# Altium schematic sheet usb_isolated_uart_x2.SchDoc
size A4; Organization: UNSW Solar Racing Team; Address3: UNSW; Address4: Sydney NSW 2052; Address2: Electrical Engineering; Address1: Room 342
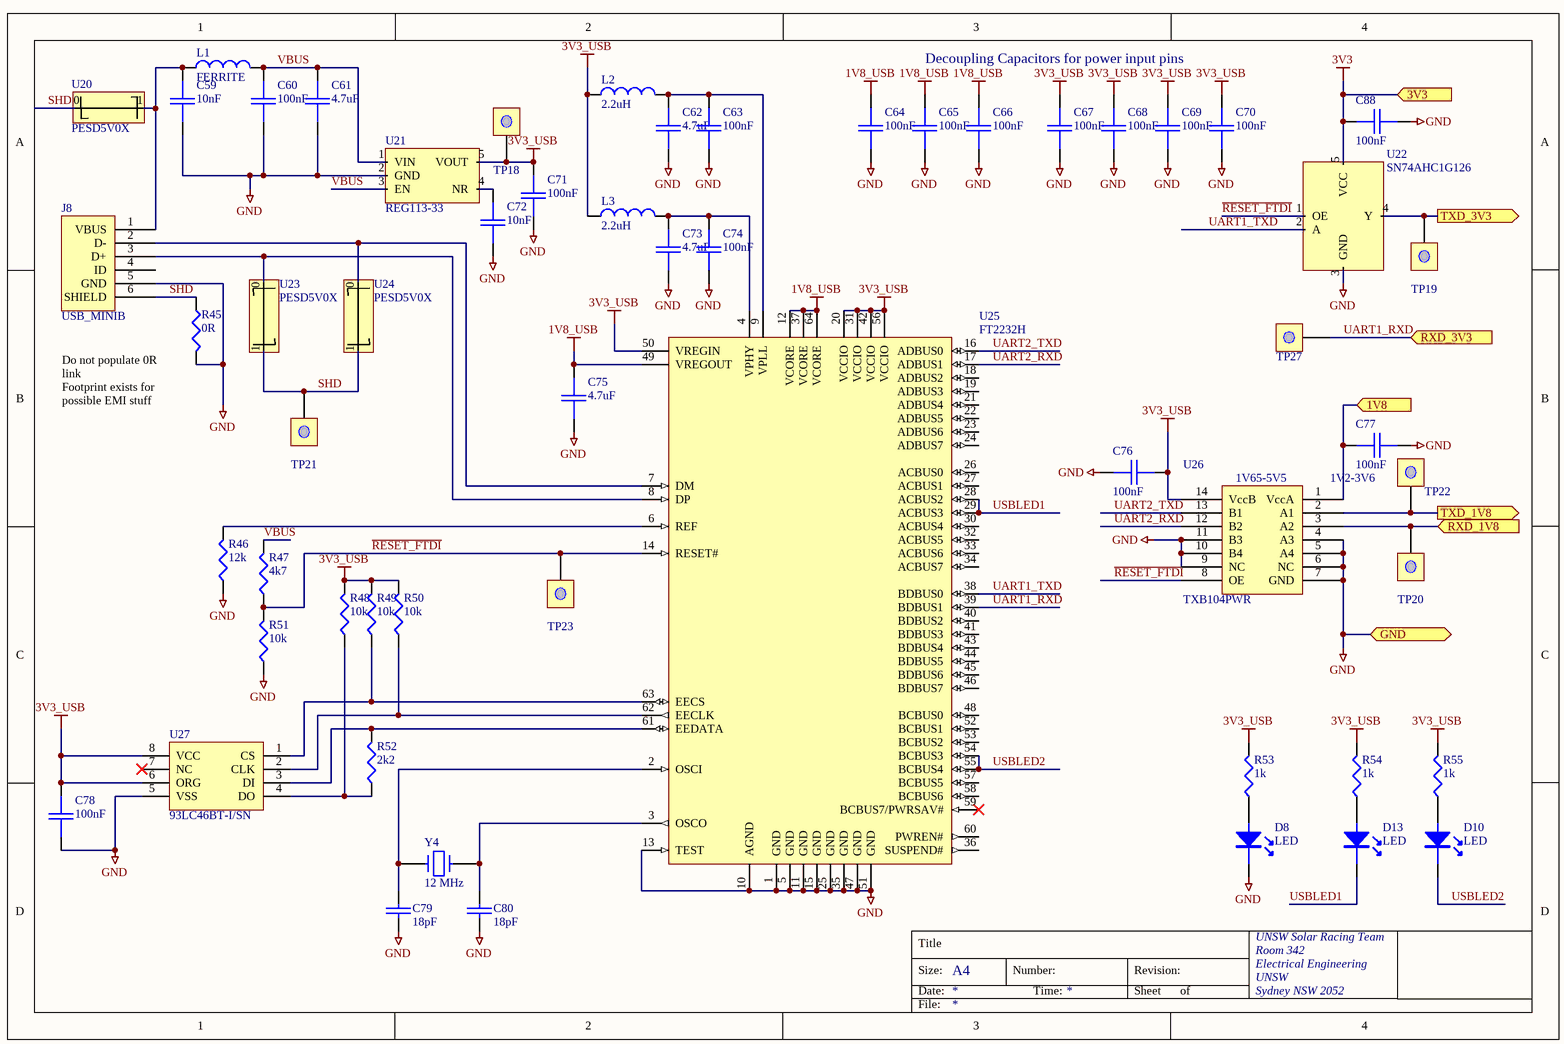
[diagram p0: usb_isolated_uart_x2.SchDoc]

## Parts
C59  10nF  [0603]
C60  100nF  [0603]
C61  4.7uF  [0603]
C62  4.7uF  [0603]
C63  100nF  [0603]
C64  100nF  [0603]
C65  100nF  [0603]
C66  100nF  [0603]
C67  100nF  [0603]
C68  100nF  [0603]
C69  100nF  [0603]
C70  100nF  [0603]
C71  100nF  [0603]
C72  10nF  [0603]
C73  4.7uF  [0603]
C74  100nF  [0603]
C75  4.7uF  [0603]
C76  100nF  [0603]
C77  100nF  [0603]
C78  100nF  [0603]
C79  18pF  [0603]
C80  18pF  [0603]
C88  100nF  [0603]
D8  LED  [0805LED]
D10  LED  [0805LED]
D13  LED  [0805LED]
J8  USB_MINIB  [USB_MINIB]
L1  FERRITE  [0603]
L2  2.2uH  [1210]
L3  2.2uH  [1210]
R45  0R  [1206]
R46  12k  [0603]
R47  4k7  [0603]
R48  10k  [0603]
R49  10k  [0603]
R50  10k  [0603]
R51  10k  [0603]
R52  2k2  [0603]
R53  1k  [0603]
R54  1k  [0603]
R55  1k  [0603]
TP18  3V3USB  [TESTPOINT]  (value not drawn)
TP19  TXD3V3  [TESTPOINT]  (value not drawn)
TP20  RXD1V8  [TESTPOINT]  (value not drawn)
TP21  SHD  [TESTPOINT]  (value not drawn)
TP22  TXD1V8  [TESTPOINT]  (value not drawn)
TP23  FTDI_RST  [TESTPOINT]  (value not drawn)
TP27  RXD3V3  [TESTPOINT]  (value not drawn)
U20  PESD5V0X  [SOD323]
U21  REG113-33  [SOT23-5]
U22  SN74AHC1G126  [SOT23-5]
U23  PESD5V0X  [SOD323]
U24  PESD5V0X  [SOD323]
U25  FT2232H  [QFP64]
U26  TXB104PWR  [TSSOP14-L]
U27  93LC46BT-I/SN  [SO8]
Y4  12 MHz  [HC49/4H]

## Ports
1V8 (in), 3V3 (in), GND (bidir), RXD_1V8 (in), RXD_3V3 (in), TXD_1V8 (out), TXD_3V3 (out)

## Nets
1V8_USB: C64.1 C65.1 C66.1 C75.1 U25.12(VCORE) U25.37(VCORE) U25.49(VREGOUT) U25.64(VCORE)
3V3: C88.2 U22.5(VCC) ; port 3V3
3V3_USB: C67.1 C68.1 C69.1 C70.1 C71.1 C76.2 C78.1 L2.1 L3.1 R48.2 R49.2 R50.2 R53.2 R54.2 R55.2 TP18.0(TP) U21.5(VOUT) U25.20(VCCIO) U25.31(VCCIO) U25.42(VCCIO) U25.50(VREGIN) U25.56(VCCIO) U26.14(VccB) U27.6(ORG) U27.8(VCC)
GND: C59.1 C60.2 C61.2 C62.2 C63.2 C64.2 C65.2 C66.2 C67.2 C68.2 C69.2 C70.2 C71.2 C72.2 C73.2 C74.2 C75.2 C76.1 C77.2 C78.2 C79.2 C80.2 C88.1 D8.K J8.5(GND) R45.2 R46.1 R51.1 U21.2(GND) U22.3(GND) U25.1(GND) U25.5(GND) U25.10(AGND) U25.11(GND) U25.13(TEST) U25.15(GND) U25.25(GND) U25.35(GND) U25.47(GND) U25.51(GND) U26.4(A3) U26.5(A4) U26.6(NC) U26.7(GND) U26.9(NC) U26.10(B4) U26.11(B3) U27.5(VSS) ; port GND
1V8: C77.1 U26.1(VccA) ; port 1V8
~{RESET_FTDI}: R47.1 R51.2 TP23.0(TP) U22.1(OE) U25.14(RESET#) U26.8(OE)
RXD_1V8: TP20.0(TP) U26.3(A2) ; port RXD_1V8
SHD: J8.6(SHIELD) R45.1 TP21.0(TP) U20.0 U23.1 U24.1
TXD_1V8: TP22.0(TP) U26.2(A1) ; port TXD_1V8
TXD_3V3: TP19.0(TP) U22.4(Y) ; port TXD_3V3
UART1_RXD: TP27.0(TP) U25.39(BDBUS1) ; port RXD_3V3
UART1_TXD: U22.2(A) U25.38(BDBUS0)
UART2_RXD: U25.17(ADBUS1) U26.12(B2)
UART2_TXD: U25.16(ADBUS0) U26.13(B1)
USBLED1: D13.K U25.28(ACBUS2) U25.29(ACBUS3)
USBLED2: D10.K U25.54(BCBUS3) U25.55(BCBUS4)
VBUS: C60.1 C61.1 L1.2 R47.2 U21.1(VIN) U21.3(EN)
NetC59_2: C59.2 J8.1(VBUS) L1.1 U20.1
NetC62_1: C62.1 C63.1 L2.2 U25.9(VPLL)
NetC72_1: C72.1 U21.4(NR)
NetC73_1: C73.1 C74.1 L3.2 U25.4(VPHY)
NetC79_1: C79.1 U25.2(OSCI) Y4.2
NetC80_1: C80.1 U25.3(OSCO) Y4.1
NetD8_A: D8.A R53.1
NetD10_A: D10.A R55.1
NetD13_A: D13.A R54.1
NetJ8_2: J8.2(D-) U24.0 U25.7(DM)
NetJ8_3: J8.3(D+) U23.0 U25.8(DP)
NetR46_2: R46.2 U25.6(REF)
NetR48_1: R48.1 R52.1 U27.4(DO)
NetR49_1: R49.1 U25.63(EECS) U27.1(CS)
NetR50_1: R50.1 U25.62(EECLK) U27.2(CLK)
NetR52_2: R52.2 U25.61(EEDATA) U27.3(DI)

Not connected (* = marked no-connect by the designer): J8 4(ID); U25 18(ADBUS2) 19(ADBUS3) 21(ADBUS4) 22(ADBUS5) 23(ADBUS6) 24(ADBUS7) 26(ACBUS0) 27(ACBUS1) 30(ACBUS4) 32(ACBUS5) 33(ACBUS6) 34(ACBUS7) 36(SUSPEND#) 40(BDBUS2) 41(BDBUS3) 43(BDBUS4) 44(BDBUS5) 45(BDBUS6) 46(BDBUS7) 48(BCBUS0) 52(BCBUS1) 53(BCBUS2) 57(BCBUS5) 58(BCBUS6) 59(BCBUS7/PWRSAV#)* 60(PWREN#); U27 7(NC)*

## Notes on the sheet
- Decoupling Capacitors for power input pins
- (near R45) Do not populate 0R link
  Footprint exists for possible EMI stuff
- Title
- Size:
- Date:
- A4
- Number:
- Time:
- Revision:
- Sheet
- of
- File:
- (in symbol TXB0104PWR) 1V65-5V5; 1V2-3V6

## Library data of the parts
C59-C78 C88 = CAP: Capacitor
  C61 C62 C73 C75: Digikey: 587-1441-1-ND; Farnell: 1688134; DigikeyPrice: 0.42; FarnellPrice: 0.585
C79 C80 = CAP: Capacitor; Order#: 721-992; Price: 0.11; Supplier: Farnell
J8 = USB_miniB_SMT: USB Mini B Connector; Farnell: 9786473; Digikey: H2961CT-ND; DigikeyPrice: 1.18; FarnellPrice: 3.08
L1-L3 = INDUCTOR: Revision: July-2002: Re-released for DXP Platform.
  L1: Digikey: 732-2389-1-ND; DigikeyPrice: 0.42; Farnell: 1748581; FarnellPrice: 0.567
  L2 L3: Farnell: 1198477; FarnellPrice: 0.353; Digikey: PCD1488CT-ND; DigikeyPrice: 0.22
R45-R55 = RES1: Resistor
  R46: Farnell: 1795293; FarnellPrice: 0.087; Digikey: P12.0KHCT-ND; DigikeyPrice: 0.04
  R47-R51 R53-R55: Farnell: Stock
  R52: Digikey: P2.20KHCT-ND; DigikeyPrice: 0.04
TP18-TP23 TP27 = TEST: TEST POINT
U20 U23 U24 = PESD5V0X: Ultra low capacitance bidirectional ESD protection diodes; Digikey: 568-4673-1-ND; Farnell: 8737606; FarnellPrice: 1.06
U21 = REG113-33: 400mA Low-Dropout Regulator; Digikey: REG113NA-3.3/3KCT-ND; DigikeyPrice: 3.15; Farnell: 1652375; FarnellPrice: 5.6
U22 = SN74AHC1G126: Single Bus Buffer Gate with 3 State Output; Digikey: 296-8746-1-ND; DigikeyPrice: 0.53; FArnell: 1287410; FarnellPrice: 0.85
U25 = FT2232H: Dual USB to UART/FIFO; Digikey: 768-1024-1-ND; Farnell: 1697461; DigikeyPrice: 6.71; FarnellPrice: 17.73
U26 = TXB0104PWR: 4 bit bidirectional auto direction sense level translator; Digikey: 296-21929-1-ND; Farnell: 1607891; FarnellPrice: 3.1; DigikeyPrice: 1.93
U27 = 93LC46BT-I/SN: Serial EEPROM; Digikey: 93LC46BT-I/SNCT-ND; Farnell: 1296585; FarnellPrice: 0.546; DigikeyPrice: 0.34
Y4 = CRYSTAL: Order#: 7940142; Price: 0.662; Supplier: Farnell
D8 D10 D13 = LED
  D8: Farnell: *; Digikey: 475-1151-1-ND; DigikeyPrice: 0.28
  D10: Digikey: 475-2676-1-ND; DigikeyPrice: 0.21
  D13: Farnell: *; Digikey: 475-2690-1-ND; DigikeyPrice: 0.21